# EAGLE design Headend (EAGLE 6.6.0)
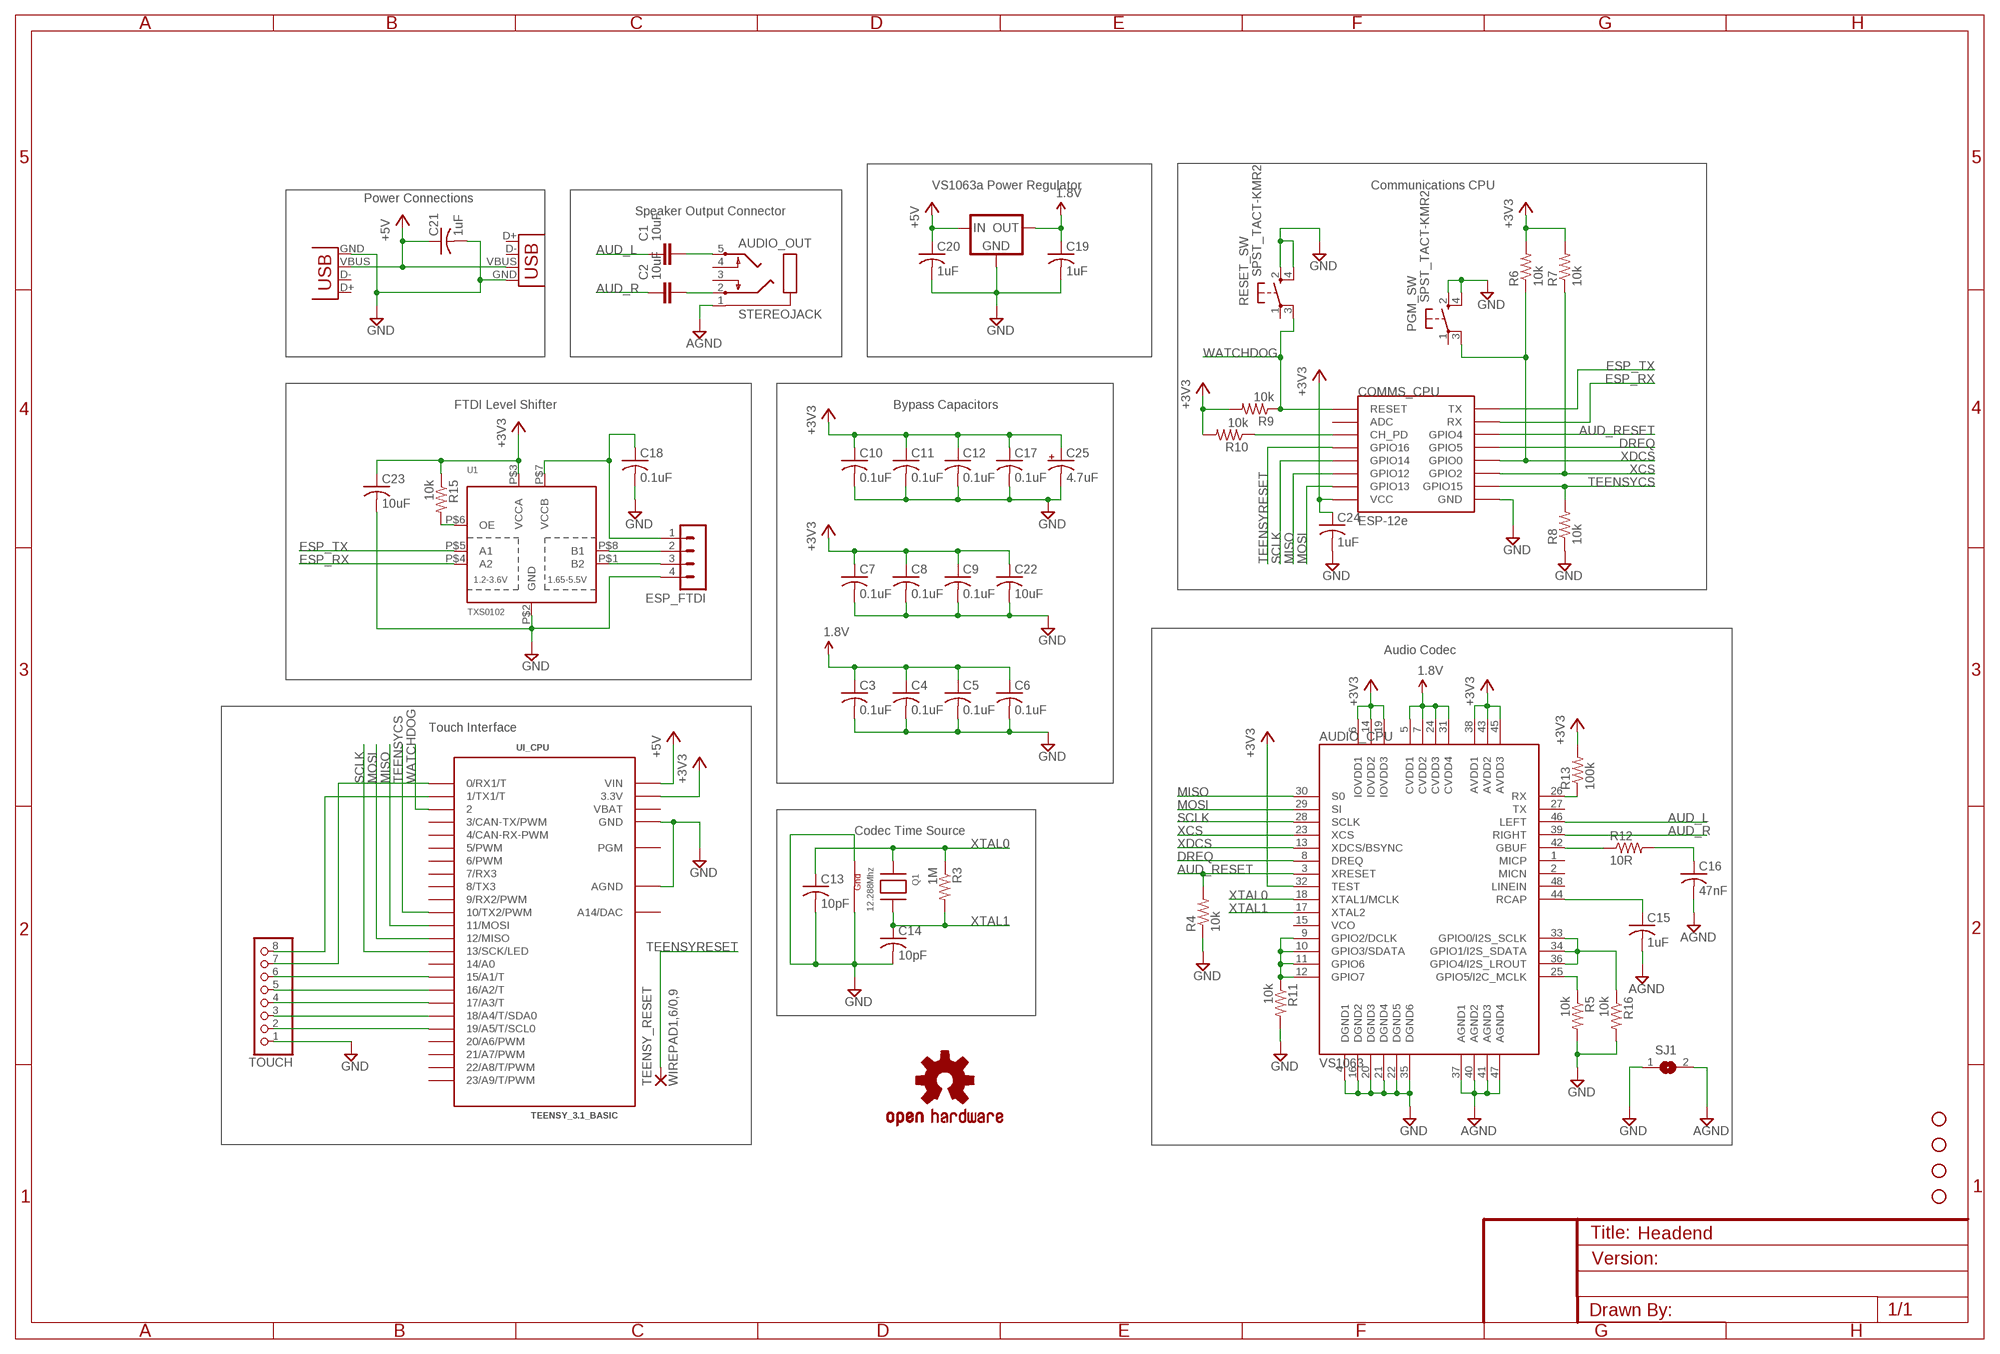
[diagram p0: schematic, sheet 1]

## Parts
AUDIO_CPU  VS1063  VS1033  [LQFP-48]
AUDIO_OUT  STEREOJACK  [STX3100]
C1  10uF  CAPACITOR_NPOL-0805  [C805]
C2  10uF  CAPACITOR_NPOL-0805  [C805]
C3  0.1uF  C-USC0402  [C0402]
C4  0.1uF  C-USC0402  [C0402]
C5  0.1uF  C-USC0402  [C0402]
C6  0.1uF  C-USC0402  [C0402]
C7  0.1uF  C-USC0402  [C0402]
C8  0.1uF  C-USC0402  [C0402]
C9  0.1uF  C-USC0402  [C0402]
C10  0.1uF  C-USC0402  [C0402]
C11  0.1uF  C-USC0402  [C0402]
C12  0.1uF  C-USC0402  [C0402]
C13  10pF  C-USC0402  [C0402]
C14  10pF  C-USC0402  [C0402]
C15  1uF  C-USC0402  [C0402]
C16  47nF  C-USC0402  [C0402]
C17  0.1uF  C-USC0402  [C0402]
C18  0.1uF  C-USC0402  [C0402]
C19  1uF  C-USC0603  [C0603]
C20  1uF  C-USC0603  [C0603]
C21  1uF  C-USC0603  [C0603]
C22  10uF  C-USC0402  [C0402]
C23  10uF  C-USC0402  [C0402]
C24  1uF  C-USC0402  [C0402]
C25  4.7uF  CPOL-USA  [PANASONIC_A]
COMMS_CPU  ESP-12e  ESP12SMD  [ESP12-SMD]
ESP_FTDI  MA04-1  [MA04-1]
LOGO1  OSHW-LOGOL  [OSHW-LOGO-L]
PGM_SW  SPST_TACT-KMR2  [KMR2]
POWER_IN  USBSMD  [USB-MINIB]
Q1  12.288Mhz  XTAL-4-3225  [NX3225]
R3  1M  R-US_R0402  [R0402]
R4  10k  R-US_R0402  [R0402]
R5  10k  R-US_R0402  [R0402]
R6  10k  R-US_R0402  [R0402]
R7  10k  R-US_R0402  [R0402]
R8  10k  R-US_R0402  [R0402]
R9  10k  R-US_R0603  [R0603]
R10  10k  R-US_R0402  [R0402]
R11  10k  R-US_R0402  [R0402]
R12  10R  R-US_R0402  [R0402]
R13  100k  R-US_R0402  [R0402]
R15  10k  R-US_R0402  [R0402]
R16  10k  R-US_R0402  [R0402]
RESET_SW  SPST_TACT-KMR2  [KMR2]
SJ1  SJ  [SJ]
SPEAKER_PWR2  USB-A-S  [USB-A-S]
STANDOFF1  STAND-OFF  [STAND-OFF]
STANDOFF2  STAND-OFF  [STAND-OFF]
STANDOFF3  STAND-OFF  [STAND-OFF]
STANDOFF4  STAND-OFF  [STAND-OFF]
TEENSY_RESET  WIREPAD1,6/0,9  [1,6/0,9]
TOUCH  PINHD-1X8BIG  [1X08-BIG]
U1  TXS0102  [VFSOP-8]
U2  AP7313  [SOT23]
UI_CPU  TEENSY_3.1_BASIC  [TEENSY_3.1_BASIC]

## Nets
1.8V: AUDIO_CPU.5(CVDD1) AUDIO_CPU.7(CVDD2) AUDIO_CPU.24(CVDD3) AUDIO_CPU.31(CVDD4) C3.1 C4.1 C5.1 C6.1 C19.1 U2.2(OUT)
+3V3: AUDIO_CPU.6(IOVDD1) AUDIO_CPU.14(IOVDD2) AUDIO_CPU.19(IOVDD3) AUDIO_CPU.32(TEST) AUDIO_CPU.38(AVDD1) AUDIO_CPU.43(AVDD2) AUDIO_CPU.45(AVDD3) C7.1 C8.1 C9.1 C10.1 C11.1 C12.1 C17.1 C22.1 C23.1 C24.1 C25.+ COMMS_CPU.VCC R6.2 R7.2 R9.2 R10.2 R13.2 R15.1 U1.P$3(VCCA) UI_CPU.3.3V UI_CPU.3.3V1(3.3V)
+5V: C20.1 C21.1 POWER_IN.VBUS SPEAKER_PWR2.VBUS U2.1(IN) UI_CPU.VIN
AGND: AUDIO_CPU.37(AGND1) AUDIO_CPU.40(AGND2) AUDIO_CPU.41(AGND3) AUDIO_CPU.47(AGND4) AUDIO_OUT.1 C15.2 C16.2 SJ1.2
AUD_L: AUDIO_CPU.46(LEFT) C1.1
AUD_R: AUDIO_CPU.39(RIGHT) C2.1
AUD_RESET: AUDIO_CPU.3(XRESET) COMMS_CPU.GPIO4 R4.2
DREQ: AUDIO_CPU.8(DREQ) COMMS_CPU.GPIO5
ESP_RX: COMMS_CPU.RXD0(RX) U1.P$4(A2)
ESP_TX: COMMS_CPU.TXD0(TX) U1.P$5(A1)
GND: AUDIO_CPU.4(DGND1) AUDIO_CPU.16(DGND2) AUDIO_CPU.20(DGND3) AUDIO_CPU.21(DGND4) AUDIO_CPU.22(DGND5) AUDIO_CPU.35(DGND6) C3.2 C4.2 C5.2 C6.2 C7.2 C8.2 C9.2 C10.2 C11.2 C12.2 C13.2 C14.2 C17.2 C18.2 C19.2 C20.2 C21.2 C22.2 C23.2 C24.2 C25.- COMMS_CPU.GND ESP_FTDI.4 PGM_SW.2(S) PGM_SW.4(S1) POWER_IN.GND Q1.2(G2) Q1.4(G1) R4.1 R5.2 R8.1 R11.2 R16.2 RESET_SW.2(S) RESET_SW.4(S1) SJ1.1 SPEAKER_PWR2.GND TOUCH.1 U1.P$2(GND) U2.3(GND) UI_CPU.AGND UI_CPU.GND UI_CPU.GND1(GND)
MISO: AUDIO_CPU.30(S0) COMMS_CPU.GPIO12 UI_CPU.11(11/MOSI)
MOSI: AUDIO_CPU.29(SI) COMMS_CPU.GPIO13 UI_CPU.12(12/MISO)
N$1: TOUCH.6 UI_CPU.15/A1(15/A1/T)
N$2: TOUCH.5 UI_CPU.16/A2(16/A2/T)
N$3: TOUCH.4 UI_CPU.17/A3(17/A3/T)
N$4: TOUCH.3 UI_CPU.18/A4(18/A4/T/SDA0)
N$7: TOUCH.2 UI_CPU.19/A5(19/A5/T/SCL0)
N$8: R15.2 U1.P$6(OE)
N$9: AUDIO_OUT.2 C2.2
N$10: AUDIO_OUT.5 C1.2
N$11: TOUCH.8 UI_CPU.1(1/TX1/T)
N$13: AUDIO_CPU.9(GPIO2/DCLK) AUDIO_CPU.10(GPIO3/SDATA) AUDIO_CPU.11(GPIO6) AUDIO_CPU.12(GPIO7) R11.1
N$14: COMMS_CPU.CH_PD R10.1
N$15: AUDIO_CPU.33(GPIO0/I2S_SCLK) AUDIO_CPU.34(GPIO1/I2S_SDATA) AUDIO_CPU.36(GPIO4/I2S_LROUT) R16.1
N$16: AUDIO_CPU.44(RCAP) C15.1
N$17: AUDIO_CPU.42(GBUF) R12.1
N$18: C16.1 R12.2
N$19: AUDIO_CPU.26(RX) R13.1
N$20: ESP_FTDI.2 U1.P$8(B1)
N$21: ESP_FTDI.3 U1.P$1(B2)
N$22: C18.1 ESP_FTDI.1 U1.P$7(VCCB)
N$23: TOUCH.7 UI_CPU.0(0/RX1/T)
N$24: AUDIO_CPU.25(GPIO5/I2C_MCLK) R5.1
SCLK: AUDIO_CPU.28(SCLK) COMMS_CPU.GPIO14 UI_CPU.13(13/SCK/LED)
TEENSYCS: COMMS_CPU.GPIO15 R8.2 UI_CPU.10(10/TX2/PWM)
TEENSYRESET: COMMS_CPU.GPIO16 TEENSY_RESET.1(P)
WATCHDOG: COMMS_CPU.RESET R9.1 RESET_SW.3(P1) UI_CPU.2
XCS: AUDIO_CPU.23(XCS) COMMS_CPU.GPIO2 R7.1
XDCS: AUDIO_CPU.13(XDCS/BSYNC) COMMS_CPU.GPIO0 PGM_SW.3(P1) R6.1
XTAL0: AUDIO_CPU.18(XTAL1/MCLK) C13.1 Q1.1(X1) R3.1
XTAL1: AUDIO_CPU.17(XTAL2) C14.1 Q1.3(X2) R3.2
Unconnected: AUDIO_CPU.1(MICP) AUDIO_CPU.2(MICN) AUDIO_CPU.15(VCO) AUDIO_CPU.27(TX) AUDIO_CPU.48(LINEIN) AUDIO_OUT.3 AUDIO_OUT.4 COMMS_CPU.ADC PGM_SW.1(P) POWER_IN.D+ POWER_IN.D- RESET_SW.1(P) SPEAKER_PWR2.D+ SPEAKER_PWR2.D- UI_CPU.3(3/CAN-TX/PWM) UI_CPU.4(4/CAN-RX-PWM) UI_CPU.5(5/PWM) UI_CPU.6(6/PWM) UI_CPU.7(7/RX3) UI_CPU.8(8/TX3) UI_CPU.9(9/RX2/PWM) UI_CPU.14/A0 UI_CPU.20/A6(20/A6/PWM) UI_CPU.21/A7(21/A7/PWM) UI_CPU.22/A8(22/A8/T/PWM) UI_CPU.23/A9(23/A9/T/PWM) UI_CPU.A14(A14/DAC) UI_CPU.PGM

## Notes on the sheet
- VS1063a Power Regulator | Communications CPU
- Power Connections
- Speaker Output Connector
- FTDI Level Shifter | Bypass Capacitors
- Audio Codec
- Touch Interface
- Codec Time Source

## Power pins joined to a net without a drawn wire
VBAT: UI_CPU.VBAT

## Library data of the parts
AUDIO_CPU = SparkFun-DigitalIC:VS1033: MP3 codec
AUDIO_OUT = adafruit:STEREOJACK: MIC/HEADPHONE JACK Stereo jack with two switches. Kycon STX3100, CUI SJ1-3555NG and/or 4UCon 05544
C1 C2 = dp_devices:CAPACITOR_NPOL: Non-Polarized capacitor in various packages
C3-C24 = adafruit:C-US: CAPACITOR, American symbol
C25 = adafruit:CPOL-US: POLARIZED CAPACITOR, American symbol
COMMS_CPU = esp8266modules:ESP12: ESP8266 Wifi module 12
ESP_FTDI = con-lstb:MA04-1: PIN HEADER; OC_FARNELL: unknown; OC_NEWARK: unknown
LOGO1 = SparkFun-Aesthetics:OSHW-LOGO: Open Source Hardware Logo This logo indicates the piece of hardware it is found on incorporates a OSHW license and/or adheres to the definition of open source hardware found here: http://freedomdefined.org/OSHW
PGM_SW RESET_SW = adafruit:SPST_TACT: SMT 6mm switch, EVQQ2 series http://www.ladyada.net/library/eagle
POWER_IN SPEAKER_PWR2 = SparkFun-Connectors:USB: USB Connectors USB-B-PTH is fully proven SKU : PRT-00139/CONN-08278 USB-miniB is fully proven SKU : PRT-00587 USB-A-PCB is untested. USB-A-H is throughly reviewed, but untested. Spark Fun Electronics SKU : PRT-00437 USB-B-SMT is throughly reviewed, but untested. Needs silkscreen touching up. USB-A-S has not been used/tested USB-MB-H has not been used/tested USB-MICROB has been used. CONN-09505
Q1 = adafruit:XTAL-4: Classic 4-pin 3.2 x 2.5mm crystal
R3-R13 R15 R16 = adafruit:R-US_: RESISTOR, American symbol
SJ1 = jumper:SJ: SMD solder JUMPER
STANDOFF1-STANDOFF4 = SparkFun-Electromechanical:STAND-OFF: #4 Stand Off This is the mechanical footprint for a #4 phillips button head screw. Use the keepout ring to avoid running the screw head into surrounding components. SKU : PRT-00447
TEENSY_RESET = wirepad:WIREPAD: Wire PAD connect wire on PCB
TOUCH = adafruit:PINHD-1X8: PIN HEADER
U1 = adafruit:TXS0102: 2-Bit Bi-Directional Level Shifter (I2C, etc.) Designed for I2C devices and has internal pullups. Not to be confused with TXB010x series. 1.2V-3.6V (VCCA) to 1.65V-5.5V (VCCB) bi-directional level shifter with auto direction sensing. Max data rate - 24Mbps (Push Pull), 2Mbps (Open Drain) Digikey: 296-21931-1-ND
U2 = CustomParts:AP7313
UI_CPU = Teensy_3_Series_Board_v1.0:TEENSY_3.1_BASIC: Footprint for Teensy 3.1 board using all pin connections on the outer perimeter

## Board
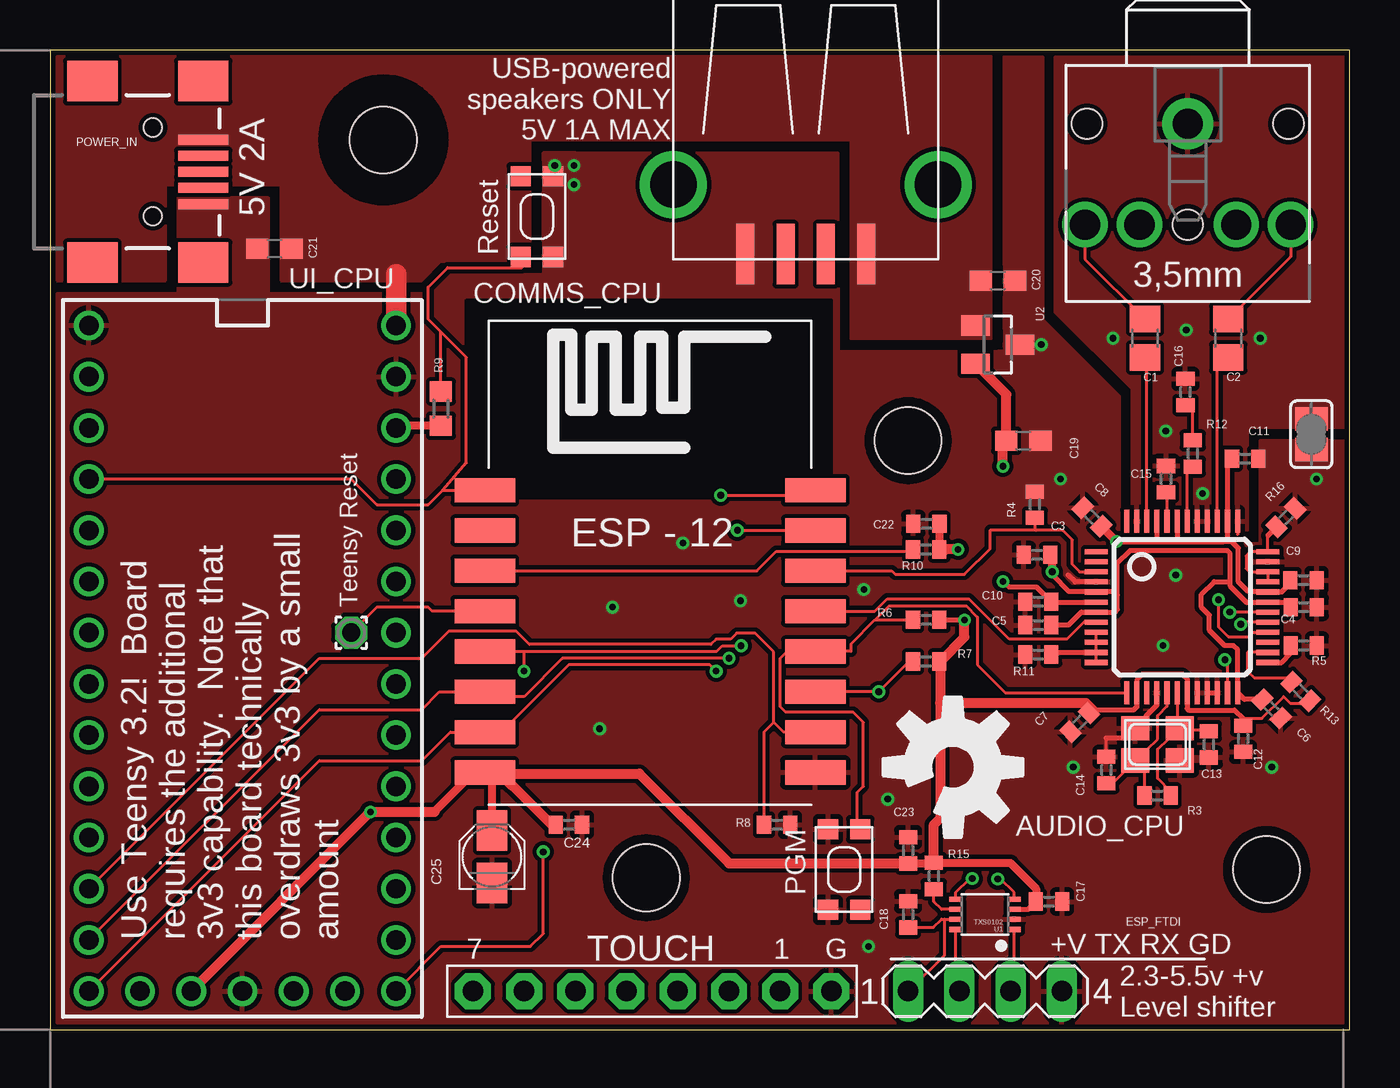
[diagram p1: board, top side]
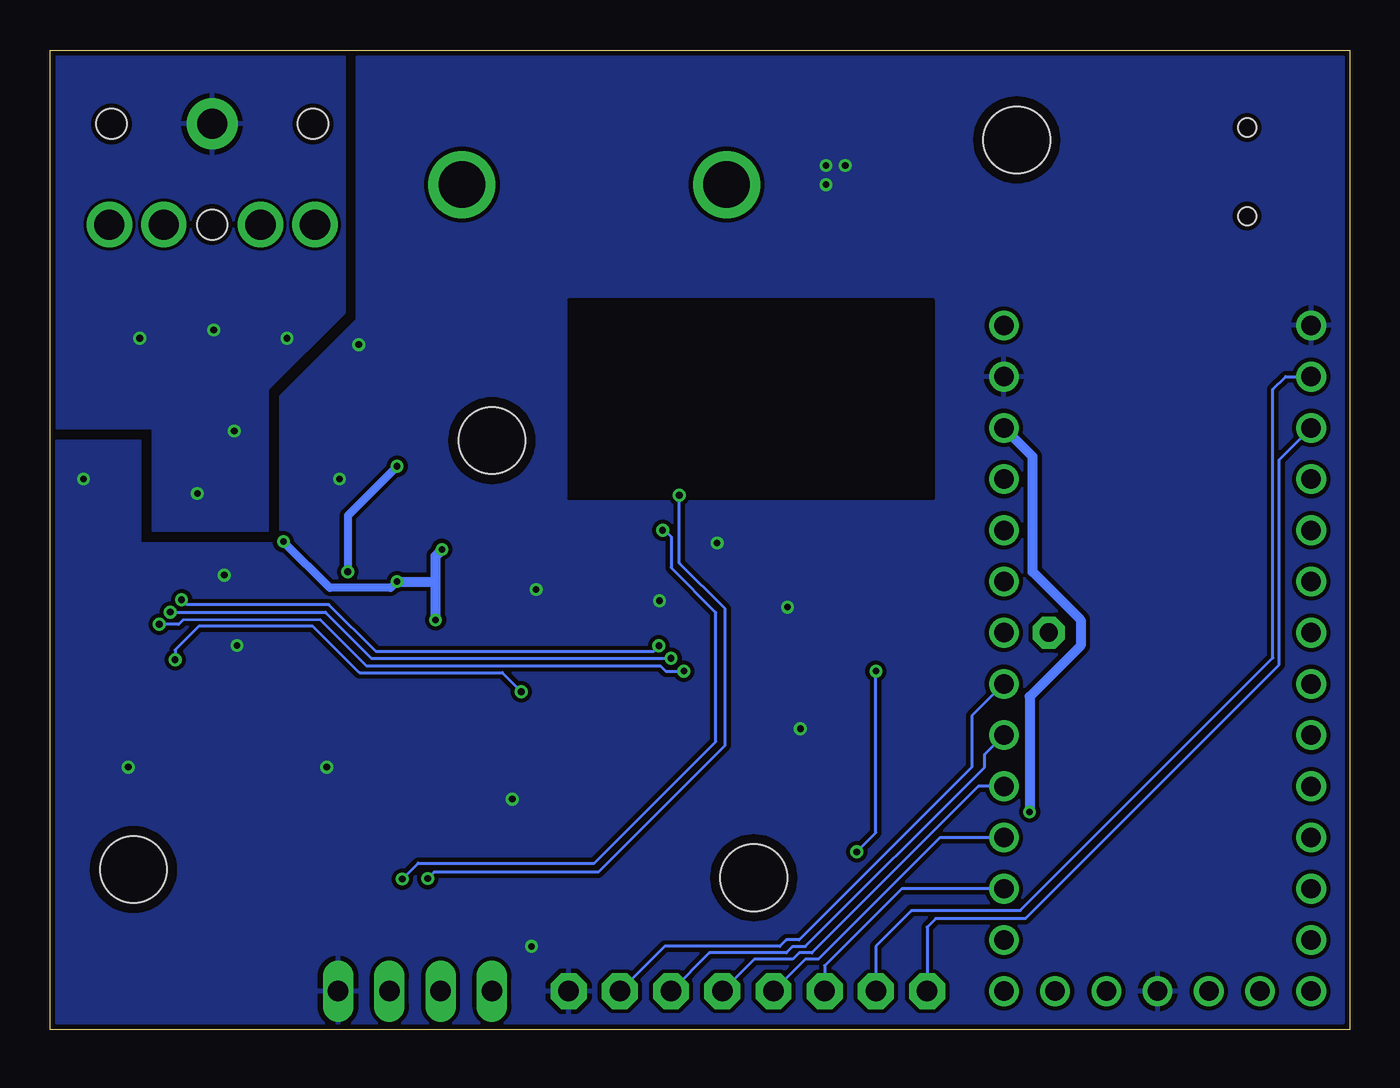
[diagram p2: board, bottom side, seen from below]

Size 64.44 x 48.57 mm. Coordinates in mm from the lower left corner, seen from the top.
Outline: 0,0 64.44,0 64.44,48.57 0,48.57 0,0
Copper layers (1*16): Top 0.035mm / dielectric 1.5mm / Bottom 0.035mm
Design rules "SeeedStudio_2layer_DRU_no_angle_20140221": minimum track width 6mil, minimum drill 12mil, track to track 6mil, track to pad 6mil, pad to pad 6mil, via to via 6mil, smd to smd 0mil, copper to edge 10mil, drill to drill 10mil, minimum pad ring 10mil, minimum via ring 6mil, stop-mask expansion 2mil, vias tented up to drill 100mil, thermal gap 10mil

### Footprints (pad centres in the part's own frame; a part is rotated, then mirrored left to right if it is on the bottom)
LQFP-48 = smd 0.254 x 1.143: 1 -2.75,-4.25; 2 -2.25,-4.25; 3 -1.75,-4.25; 4 -1.25,-4.25; 5 -0.75,-4.25; 6 -0.25,-4.25; 7 0.25,-4.25; 8 0.75,-4.25; 9 1.25,-4.25; 10 1.75,-4.25; 11 2.25,-4.25; 12 2.75,-4.25; 25 2.75,4.25; 26 2.25,4.25; 27 1.75,4.25; 28 1.25,4.25; 29 0.75,4.25; 30 0.25,4.25; 31 -0.25,4.25; 32 -0.75,4.25; 33 -1.25,4.25; 34 -1.75,4.25; 35 -2.25,4.25; 36 -2.75,4.25 | smd 1.143 x 0.254: 13 4.25,-2.75; 14 4.25,-2.25; 15 4.25,-1.75; 16 4.25,-1.25; 17 4.25,-0.75; 18 4.25,-0.25; 19 4.25,0.25; 20 4.25,0.75; 21 4.25,1.25; 22 4.25,1.75; 23 4.25,2.25; 24 4.25,2.75; 37 -4.25,2.75; 38 -4.25,2.25; 39 -4.25,1.75; 40 -4.25,1.25; 41 -4.25,0.75; 42 -4.25,0.25; 43 -4.25,-0.25; 44 -4.25,-0.75; 45 -4.25,-1.25; 46 -4.25,-1.75; 47 -4.25,-2.25; 48 -4.25,-2.75
STX3100 = drill 1.5 pad 2.54: 1 2.7,-0.1 | drill 1.5: 2 7.7,5; 3 7.7,2.3; 4 7.7,-2.5; 5 7.7,-5.2 | hole 1.5: 2.7,4.9; 2.7,-5.1; 7.7,-0.1
C805 = smd 1.3 x 1.5: 1 -0.95,0; 2 0.95,0
C0402 = smd 0.7 x 0.9: 1 -0.65,0; 2 0.65,0
C0603 = smd 1.1 x 1: 1 -0.85,0; 2 0.85,0
PANASONIC_A = smd 2 x 1.5: + 1.3,0; - -1.3,0
ESP12-SMD = smd 3 x 1.2: ADC -8.3,3.8; CH_PD -8.3,1.8; GND 8.1,-8.2; GPIO0 8.1,-2.2; GPIO2 8.1,-4.2; GPIO4 8.1,1.8; GPIO5 8.1,-0.2; GPIO12 -8.3,-4.2; GPIO13 -8.3,-6.2; GPIO14 -8.3,-2.2; GPIO15 8.1,-6.2; GPIO16 -8.3,-0.2; RESET -8.3,5.8; RXD0 8.1,3.8; TXD0 8.1,5.8; VCC -8.3,-8.2
MA04-1 = drill 1.016 long: 1 -3.81,0; 2 -1.27,0; 3 1.27,0; 4 3.81,0
KMR2 = smd 1 x 1: 1 2,0.8; 2 2,-0.8; 3 -2,0.8; 4 -2,-0.8
USB-MINIB = smd 2.5 x 0.5: D+ 2.5,0; D- 2.5,0.8; GND 2.5,-1.6; ID 2.5,-0.8; VBUS 2.5,1.6 | smd 2.5 x 2: MTN1 -3,4.5; MTN2 2.5,4.5; MTN3 -3,-4.5; MTN4 2.5,-4.5 | hole 0.9: 0,2.2; 0,-2.2
NX3225 = smd 1.4 x 1.2: 1 -1.1,-0.8; 2 1.1,-0.8; 3 1.1,0.8; 4 -1.1,0.8
R0402 = smd 0.7 x 0.9: 1 -0.65,0; 2 0.65,0
R0603 = smd 1 x 1.1: 1 -0.85,0; 2 0.85,0
SJ = smd 1.168 x 1.6: 1 -0.762,0; 2 0.762,0
USB-A-S = smd 3 x 0.9: D+ 3.45,-1; D- 3.45,1; GND 3.45,-3; VBUS 3.45,3 | drill 2.311: P$5 0,-6.566; P$6 0,6.566
STAND-OFF = hole 3.302: 0,0
1,6/0,9 = drill 0.914 pad 1.6 octagon: 1 0,0
1X08-BIG = drill 1.016 pad 1.778 octagon: 1 -8.89,0; 2 -6.35,0; 3 -3.81,0; 4 -1.27,0; 5 1.27,0; 6 3.81,0; 7 6.35,0; 8 8.89,0
VFSOP-8 = smd 0.25 x 0.65: P$1 -0.75,-1.45; P$2 -0.25,-1.45; P$3 0.25,-1.45; P$4 0.75,-1.45; P$5 0.75,1.45; P$6 0.25,1.45; P$7 -0.25,1.45; P$8 -0.75,1.45
SOT23 = smd 1 x 1.4: 1 -0.95,-1.1; 2 0.95,-1.1; 3 0,1.1
TEENSY_3.1_BASIC = drill 0.965: 0 -7.62,13.97; 1 -7.62,11.43; 2 -7.62,8.89; 3 -7.62,6.35; 3.3V 7.62,11.43; 3.3V1 -2.54,-16.51; 4 -7.62,3.81; 5 -7.62,1.27; 6 -7.62,-1.27; 7 -7.62,-3.81; 8 -7.62,-6.35; 9 -7.62,-8.89; 10 -7.62,-11.43; 11 -7.62,-13.97; 12 -7.62,-16.51; 13 7.62,-16.51; 14/A0 7.62,-13.97; 15/A1 7.62,-11.43; 16/A2 7.62,-8.89; 17/A3 7.62,-6.35; 18/A4 7.62,-3.81; 19/A5 7.62,-1.27; 20/A6 7.62,1.27; 21/A7 7.62,3.81; 22/A8 7.62,6.35; 23/A9 7.62,8.89; A14 5.08,-16.51; AGND 7.62,13.97; GND -7.62,16.51; GND1 0,-16.51; PGM 2.54,-16.51; VBAT -5.08,-16.51; VIN 7.62,16.51

### Placement (x,y rotation side)
AUDIO_CPU  56.13,20.95 270 top
AUDIO_OUT  56.52,47.62 270 top
C1  54.29,34.29 90 top
C2  58.42,34.29 90 top
C3  48.93,23.55 180 top
C4  62.17,20.95 0 top
C5  49,20.07 180 top
C6  60.57,15.91 315 top
C7  51.05,15.24 225 top
C8  51.66,25.43 135 top
C9  62.15,22.29 0 top
C10  49,21.22 180 top
C11  59.26,28.32 0 top
C12  59.16,14.43 270 top
C13  57.45,14.15 270 top
C14  52.37,12.88 90 top
C15  55.33,27.3 90 top
C16  56.3,31.62 90 top
C17  49.53,6.35 0 top
C18  42.55,5.71 90 top
C19  48.26,29.21 0 top
C20  46.99,37.15 0 top
C21  11.11,38.73 180 top
C22  43.45,25.08 180 top
C23  42.55,8.89 90 top
C24  25.72,10.16 0 top
C25  21.91,8.57 90 top
COMMS_CPU  29.84,20.95 0 top
ESP_FTDI  46.36,1.91 0 top
LOGO1  44.77,13.02 315 top
PGM_SW  39.37,7.94 270 top
POWER_IN  5.08,42.55 0 top
Q1  54.91,14.15 180 top
R3  54.91,11.61 180 top
R4  48.83,26.04 270 top
R5  62.17,19.05 0 top
R6  43.43,20.32 0 top
R7  43.43,18.26 0 top
R8  36.04,10.16 180 top
R9  19.37,30.8 270 top
R10  43.43,23.81 0 top
R11  49,18.6 180 top
R12  56.66,28.57 90 top
R13  62.01,16.78 315 top
R15  43.82,7.62 270 top
R16  61.28,25.4 45 top
RESET_SW  24.13,40.32 90 top
SJ1  62.55,29.53 90 top
SPEAKER_PWR2  37.47,41.91 270 top
STANDOFF1  60.33,7.94 0 top
STANDOFF2  42.55,29.21 0 top
STANDOFF3  29.55,7.53 0 top
STANDOFF4  16.51,44.13 0 top
TEENSY_RESET  14.92,19.68 0 top
TOUCH  29.84,1.91 180 top
U1  46.36,5.71 90 top
U2  46.99,33.97 270 top
UI_CPU  9.53,18.41 0 top

### Tracks (layer width: path | path; a pad name or v marks a point on that pad's centre or on a via)
1.8V  (via drill 0.33 pad 0.51)
  Top 0.152: 52.93,21.56 52.77,21.72 | 51.9,21.72 AUDIO_CPU.5 | 61.58,21.2 C4.1
  Top 0.254: 52.77,21.72 51.9,21.72 50.53,21.72 49.72,22.56 v49.69,22.71 | 61.58,21.2 AUDIO_CPU.31 59.31,21.2 58.5,22.02 58.5,22.23 | 58.5,22.23 58.49,23.66 58.38,23.76 53.54,23.76 52.93,23.15 52.93,21.56 52.93,20.83 52.8,20.7 AUDIO_CPU.7 51.13,20.7 50.5,20.07 C5.1 | 58.5,22.23 58.49,22.22 57.72,22.22 57.09,21.59 57.09,20.95 57.48,20.56 57.48,19.81 58.24,19.05 58.67,19.05 58.88,18.84 AUDIO_CPU.24 59.22,16.37 C6.1
  Top 0.406: v49.69,22.71 49.69,23.44 C3.1
  Top 0.508: v47.24,27.94 47.24,29.04 C19.1 47.41,31.5 U2.2
  Bottom 0.406: v47.24,27.94 49.69,25.49 v49.69,22.71
+3V3  (via drill 0.33 pad 0.18, 0.33 pad 0.36, 0.33 pad 0.51)
  Top 0.152: 56.36,16.68 AUDIO_CPU.19 | AUDIO_CPU.6 | AUDIO_CPU.38 58.42,25.24 | AUDIO_CPU.43 | R15.1 43.82,8.47 | 44.28,20.23 R6.2 | R7.2 44.28,18.41 | 59.16,15.43 60.08,15.43 61.16,16.51 61.33,16.36 61.49,16.19 62.67,16.19
  Top 0.254: R6.2 v45.34,20.32 | AUDIO_CPU.45 54.88,24.2 | 58.19,24.2 58.38,24.4 AUDIO_CPU.38 58.38,28.32 C11.1 | 47.24,22.2 v47.24,22.22 47.55,21.96 48.91,21.96 C10.1 49.66,21.2 AUDIO_CPU.6 | 55.88,24.2 58.19,24.2 | 58.19,24.2 58.6,24.2 58.93,23.88 58.93,22.21 59.42,21.72 AUDIO_CPU.32 61.08,21.7 61.5,22.13 C9.1 | AUDIO_CPU.43 55.88,24.2 | 54.88,24.2 55.88,24.2 | C8.1 52.32,24.76 | v52.88,24.21 54.73,24.21 54.88,24.2 | U1.P$3 48.5,5.96 C17.1 | 51.72,15.88 51.7,15.86 51.69,15.85 53.72,15.85 53.88,16.01 AUDIO_CPU.14 53.88,17.34 54.18,17.64 56.14,17.64 56.38,17.4 AUDIO_CPU.19 56.38,15.92 56.45,15.85 58.74,15.85 59.16,15.43 C12.1 59.03,15.21 | 62.67,16.19 R13.2
  Top 0.406: 51.7,15.86 C7.1 | 44.13,18.26 R7.2 | v52.88,24.21 52.32,24.76 | 19.05,10.79 21.01,12.76 COMMS_CPU.VCC 21.91,12.76 C25.+ | C17.1 48.9,6.99 47.62,8.26 47.62,8.27 R15.1 43.79,8.24 C23.1 | R9.2 17.25,29.95 UI_CPU.3.3V | 22.86,12.06 22.22,12.7 | C22.1 44.08,25.02 R10.2
  Top 0.508: v45.02,23.81 R10.2 44.28,23.69 | UI_CPU.3.3V1 v15.88,10.79 19.05,10.79 | v45.34,20.32 45.34,19.47 44.13,18.26 | 51.7,15.86 51.37,16.19 44.13,16.19 | 43.82,8.47 43.82,10.16 44.13,10.48 44.13,16.19 | R7.2 44.13,18.21 44.13,16.19 | C23.1 33.67,8.24 29.21,12.7 22.22,12.7 21.6,12.7 COMMS_CPU.VCC 22.27,12.76 24.87,10.16 C24.1
  Bottom 0.406: v52.88,24.21 50.58,21.91 47.56,21.91 v47.24,22.22
  Bottom 0.508: v47.24,22.22 45.34,22.22 | v45.34,20.32 45.34,22.22 | UI_CPU.3.3V 15.72,28.42 15.72,22.7 13.34,20.32 13.34,19.05 15.88,16.51 v15.88,10.79 | 45.34,22.22 45.34,23.49 v45.02,23.81
+5V
  Top 1.016: UI_CPU.VIN 17.14,37.47
  pour Top (isolate 0.203, no thermals): 0.32,37.15 5.71,37.15 5.71,41.91 11.43,41.91 11.43,37.15 18.41,37.15 19.37,38.1 23.81,38.1 23.81,44.13 39.69,44.13 39.69,34.29 46.67,34.29 46.67,48.26 0.32,48.26
  cutout Top (no thermals): 16.51,40.96 arc90 19.68,44.13 arc90 16.51,47.31 arc90 13.34,44.13 arc90
AGND  (via drill 0.33 pad 0.18)
  Top 0.152: 53.87,25.19 AUDIO_CPU.47 | AUDIO_CPU.37 58.88,24.55
  other vias: 52.71,34.29 60.01,34.29 56.34,34.7 57.15,26.59 55.32,29.69
  pour Top (isolate 0.203): 49.85,48.26 64.13,48.26 64.13,29.84 59.37,29.84 59.37,24.76 53.66,24.76 53.66,31.75 49.85,35.56
  pour Bottom: 49.85,48.26 64.13,48.26 64.13,29.84 59.37,29.84 59.37,24.76 53.66,24.76 53.66,31.75 49.85,35.56
  pour Top (no thermals): 60.33,29.84 60.33,31.43 63.82,31.43 63.82,29.84
AUD_L
  Top 0.152: AUDIO_CPU.46 54.38,33.11 C1.1
AUD_R
  Top 0.152: AUDIO_CPU.39 57.88,32.8 C2.1
AUD_RESET
  Top 0.152: COMMS_CPU.GPIO4 41.73,22.75 41.91,22.57 45.34,22.57 46.61,23.84 46.61,24.76 48.9,24.76 | AUDIO_CPU.3 51.05,22.7 50.69,23.07 50.69,24.29 50.21,24.76 48.9,24.76 | R4.2 48.83,24.83 48.9,24.76
DREQ
  Top 0.152: COMMS_CPU.GPIO5 40.9,20.75 41.51,21.37 45.56,21.37 47.56,19.37 50.42,19.37 51.28,20.22 51.86,20.22 AUDIO_CPU.8
ESP_RX  (via drill 0.33 pad 0.18, 0.33 pad 0.51)
  Top 0.152: v34.07,24.77 37.46,24.77 37.47,24.76 COMMS_CPU.RXD0 | U1.P$4 47.8,6.81 47.14,7.47 v46.99,7.47
  Bottom 0.152: v34.07,24.77 33.98,24.77 33.66,24.45 33.66,22.91 31.43,20.68 31.43,14.29 37.47,8.26 46.2,8.26 v46.99,7.47
ESP_TX  (via drill 0.33 pad 0.18)
  Top 0.152: U1.P$5 44.91,6.81 45.59,7.49 v45.72,7.49 | v33.25,26.5 37.69,26.5 COMMS_CPU.TXD0
  Bottom 0.152: v33.25,26.5 33.25,23.14 30.97,20.86 30.97,14.1 37.27,7.81 45.4,7.81 v45.72,7.49
GND  (via drill 0.33 pad 0.18)
  Top 0.152: 37.47,12.28 COMMS_CPU.GND | C14.2 52.36,14.47 | 53.63,14.78 53.8,14.95 Q1.2 53.33,14.47
  Top 0.254: AUDIO_CPU.22 AUDIO_CPU.21 57.4,16.68 | 52.36,14.47 53.33,14.47 | 53.91,15.24 53.91,14.79 Q1.2 54.33,15.46 54.33,15.54 54.88,16.1 AUDIO_CPU.16 | AUDIO_CPU.4 50.82,22.2 50.48,22.54
  other vias: 40.35,21.83 55.18,19.05 55.82,22.54 62.8,27.3 50.74,13.02 60.58,13.02 50.1,27.3 40.58,4.13 41.53,11.43 27.24,14.92 27.88,20.95 34.23,21.27 31.37,24.13 25.97,41.91 25.02,42.86 25.97,42.86 49.15,33.97
  pour Bottom (isolate 0.203): 0.32,48.26 0.32,0.32 64.13,0.32 64.13,29.21 60.01,29.21 60.01,24.13 53.02,24.13 53.02,31.43 49.21,35.24 49.21,48.26
  pour Top (isolate 0.203): 0.32,0.32 0.32,36.51 6.35,36.51 6.35,41.27 10.79,41.27 10.79,36.51 18.73,36.51 19.68,37.47 24.45,37.47 24.45,43.5 31.11,43.5 39.05,43.48 39.07,33.64 47.31,33.64 47.31,48.26 49.21,48.26 49.21,35.24 53.02,31.43 53.02,24.13 60.01,24.13 60.01,29.21 64.13,29.21 64.13,0.32
  pour Top (isolate 0.203, no thermals): 6.35,41.27 9.53,41.27 9.53,40.32 6.35,40.32
  pour Top (isolate 0.203, no thermals): 24.45,43.5 24.45,37.47 26.04,37.47 26.04,43.5
  pour Top (no thermals): 33.34,36.51 35.56,36.51 35.56,40.64 33.34,40.64
  pour Top (no thermals): 60.01,29.21 60.01,27.3 63.5,27.62 63.5,29.21
  pour Top (no thermals): 47.31,38.42 47.31,33.66 46.99,33.66 46.99,33.02 49.53,33.02 49.53,34.61 49.21,34.61 49.21,38.42
  pour Top (no thermals): 10.79,40.01 10.79,37.47 9.21,37.47 9.21,40.01
  pour Top (isolate 0.203, no thermals): 47.94,26.04 47.94,27.3 49.53,27.3 49.53,26.04
  pour Top (no thermals): 48.58,30.16 48.26,30.16 48.26,28.26 50.16,28.26 50.16,30.16
MISO  (via drill 0.33 pad 0.51)
  Top 0.152: UI_CPU.11 13.34,15.88 18.41,15.88 19.29,16.75 COMMS_CPU.GPIO12 21.79,16.51 23.49,16.51 25.4,18.41 v33.66,18.41 | AUDIO_CPU.30 58.72,20.7 v58.5,20.7
  Bottom 0.152: v58.5,20.7 50.8,20.7 48.51,18.41 v33.66,18.41
MOSI  (via drill 0.33 pad 0.18, 0.33 pad 0.51)
  Top 0.152: UI_CPU.12 13.34,13.34 18.41,13.34 19.83,14.76 COMMS_CPU.GPIO13 21.69,14.61 22.22,14.61 25.72,18.1 32.7,18.1 v33.02,17.78 | AUDIO_CPU.29 59.19,20.2 59.09,20.1 v59.04,20.1
  Bottom 0.152: v33.02,17.78 33.93,17.78 34.18,18.04 48.77,18.04 51.05,20.32 57.87,20.31 58.08,20.1 v59.04,20.1
N$1
  Bottom 0.152: UI_CPU.15/A1 22.22,6.99 26.04,3.17 TOUCH.6
N$2
  Bottom 0.152: UI_CPU.16/A2 20.32,9.53 26.35,3.49 26.99,3.49 TOUCH.5
N$3
  Bottom 0.152: UI_CPU.17/A3 18.41,12.06 26.67,3.81 27.3,3.81 27.62,3.49 29.53,3.49 TOUCH.4
N$4
  Bottom 0.152: UI_CPU.18/A4 18.1,13.65 18.1,13.02 26.99,4.13 27.62,4.13 27.94,3.81 31.75,3.81 TOUCH.3
N$5
  cutout Top (rank 2): 20.64,36.2 38.73,36.2 38.73,26.35 20.64,26.35
  cutout Bottom (rank 2): 20.64,36.2 38.73,36.2 38.73,26.35 20.64,26.35
N$7
  Bottom 0.152: UI_CPU.19/A5 18.73,15.56 18.73,13.02 27.3,4.45 27.94,4.45 28.26,4.13 33.97,4.13 TOUCH.2
N$8
  Top 0.152: U1.P$6 44.2,5.96 43.82,6.35 R15.2
N$9
  Top 0.152: C2.2 61.52,38.34 AUDIO_OUT.2
N$10
  Top 0.152: AUDIO_OUT.5 51.32,38.22 C1.2
N$11
  Bottom 0.152: UI_CPU.1 3.49,28.26 3.49,18.1 16.09,5.5 20.54,5.5 20.95,5.08 TOUCH.8
N$13
  Top 0.152: AUDIO_CPU.12 AUDIO_CPU.11 AUDIO_CPU.10 AUDIO_CPU.9
  Top 0.254: R11.1 50.07,18.7 AUDIO_CPU.11
N$14
  Top 0.152: COMMS_CPU.CH_PD 35.04,22.75 36,23.72 42.36,23.72 R10.1
N$15
  Top 0.152: AUDIO_CPU.33 AUDIO_CPU.34 59.46,22.7 59.31,22.86 59.31,23.49 59.52,23.7 AUDIO_CPU.36 60.38,24.51
  Top 0.254: 60.38,24.51 R16.1
N$16
  Top 0.152: AUDIO_CPU.44 55.38,26.6 C15.1
N$17
  Top 0.152: 56.45,28.03 R12.1 56.38,27.92 AUDIO_CPU.42
N$18
  Top 0.152: R12.2 56.66,30.62 C16.1
N$19
  Top 0.152: AUDIO_CPU.26 59.37,18.7 59.37,17.78 59.73,17.43 61.68,17.43 arc-90 R13.1
N$20
  Top 0.152: ESP_FTDI.2 44.91,2.08 U1.P$8
N$21
  Top 0.152: ESP_FTDI.3 47.8,2.08 U1.P$1
N$22
  Top 0.152: ESP_FTDI.1 44.35,3.68 44.35,5.47 | C18.1 43.8,5.07 44.21,5.47 44.35,5.47 | 44.35,5.47 44.36,5.46 U1.P$7
N$23
  Bottom 0.152: UI_CPU.0 3.17,32.39 3.81,31.75 3.81,18.44 16.33,5.92 21.73,5.92 21.73,5.89 23.49,4.13 TOUCH.7
N$24
  Top 0.254: AUDIO_CPU.25 61.07,18.2 61.52,18.65 R5.1
SCLK  (via drill 0.33 pad 0.18, 0.33 pad 0.51)
  Top 0.152: COMMS_CPU.GPIO14 23.49,18.75 | 23.49,18.75 33.04,18.75 33.32,19.04 v34.26,19.04 | v57.93,21.32 57.93,19.98 58.42,19.5 59.44,19.5 59.63,19.68 59.94,19.68 AUDIO_CPU.28 | UI_CPU.13 19.37,4.13 23.81,4.13 24.45,4.76 v24.45,8.81 | v23.49,17.78 23.49,18.75
  Bottom 0.152: v34.26,19.04 34.25,19.04 34.54,18.74 48.28,18.74 50.63,21.08 57.7,21.08 v57.93,21.32 | v24.45,8.81 23.49,9.77 v23.49,17.78
TEENSYCS
  Top 0.152: UI_CPU.10 13.34,18.41 18.41,18.41 19.76,19.76 23.1,19.76 23.76,19.1 32.75,19.1 33.02,19.37 33.74,19.37 34.04,19.66 34.95,19.66 35.88,18.73 35.88,15.24 | COMMS_CPU.GPIO15 36.36,14.76 35.88,15.24 | 35.88,15.24 35.39,14.76 R8.2
TEENSYRESET
  Top 0.152: COMMS_CPU.GPIO16 18.93,20.75 18.73,20.95 16.19,20.95 TEENSY_RESET.1
WATCHDOG
  Top 0.152: 21.54,27.03 COMMS_CPU.RESET 19.45,26.75 | 19.45,26.75 18.73,26.04 16.19,26.04 14.92,27.3 UI_CPU.2 | 19.37,34.61 20.64,33.34 20.64,28.11 19.45,26.75 | R9.1 19.37,34.61 | 19.37,34.61 18.73,35.24 18.73,36.83 19.7,37.8 23.39,37.8 23.41,37.84 RESET_SW.3
XCS  (via drill 0.33 pad 0.18, 0.33 pad 0.51)
  Top 0.152: COMMS_CPU.GPIO2 v41.08,16.75 42.58,18.26 R7.1 | AUDIO_CPU.23 58.38,18.22 v58.25,18.35
  Bottom 0.152: 41.75,17.42 v41.08,16.75 42.03,17.7 49.12,17.7 51.42,20 57.09,20 58.25,18.83 v58.25,18.35
XDCS
  Top 0.152: 37.61,18.41 COMMS_CPU.GPIO0 | 40.92,20.32 40.89,20.32 39.71,19.14 39.71,18.75 COMMS_CPU.GPIO0 | 40.92,20.32 R6.1 | AUDIO_CPU.13 47.37,16.7 45.97,18.1 45.97,20.46 45.42,21.01 41.61,21.01 40.92,20.32 | COMMS_CPU.GPIO0 37.92,18.73 36.51,18.73 36.2,18.41 36.2,16.01 36.46,15.75 39.82,15.75 40.32,15.24 40.32,12.06 40.01,11.75 40.01,9.77 PGM_SW.3
XTAL0
  Top 0.152: Q1.1 54.91,13.91 54.91,12.46 55.57,11.81 R3.1 | Q1.1 56.04,14.95 56.47,14.88 57.38,14.88 C13.1 | 55.96,15 Q1.1 | AUDIO_CPU.18 55.88,15.08 Q1.1
XTAL1
  Top 0.152: C14.1 52.7,12.23 Q1.3 | Q1.3 53.82,13.37 54.41,13.89 54.91,14.4 54.91,15.57 55.37,16.03 55.37,16.69 AUDIO_CPU.17 | Q1.3 54.07,13.1 54.27,13.1 R3.2

### Text on the board
tNames: USB-powered / speakers ONLY / 5V 1A MAX | 5V 2A | Reset | Teensy Reset | PGM | Use Teensy 3.2! Board / requires the additional / 3v3 capability. Note that / this board technically / overdraws 3v3 by a small / amount | 7 | 1 | G | +V TX RX GD | 2.3-5.5v +v / Level shifter